# Altium schematic sheet TP_IHM_MAIN.SchDoc
size A4
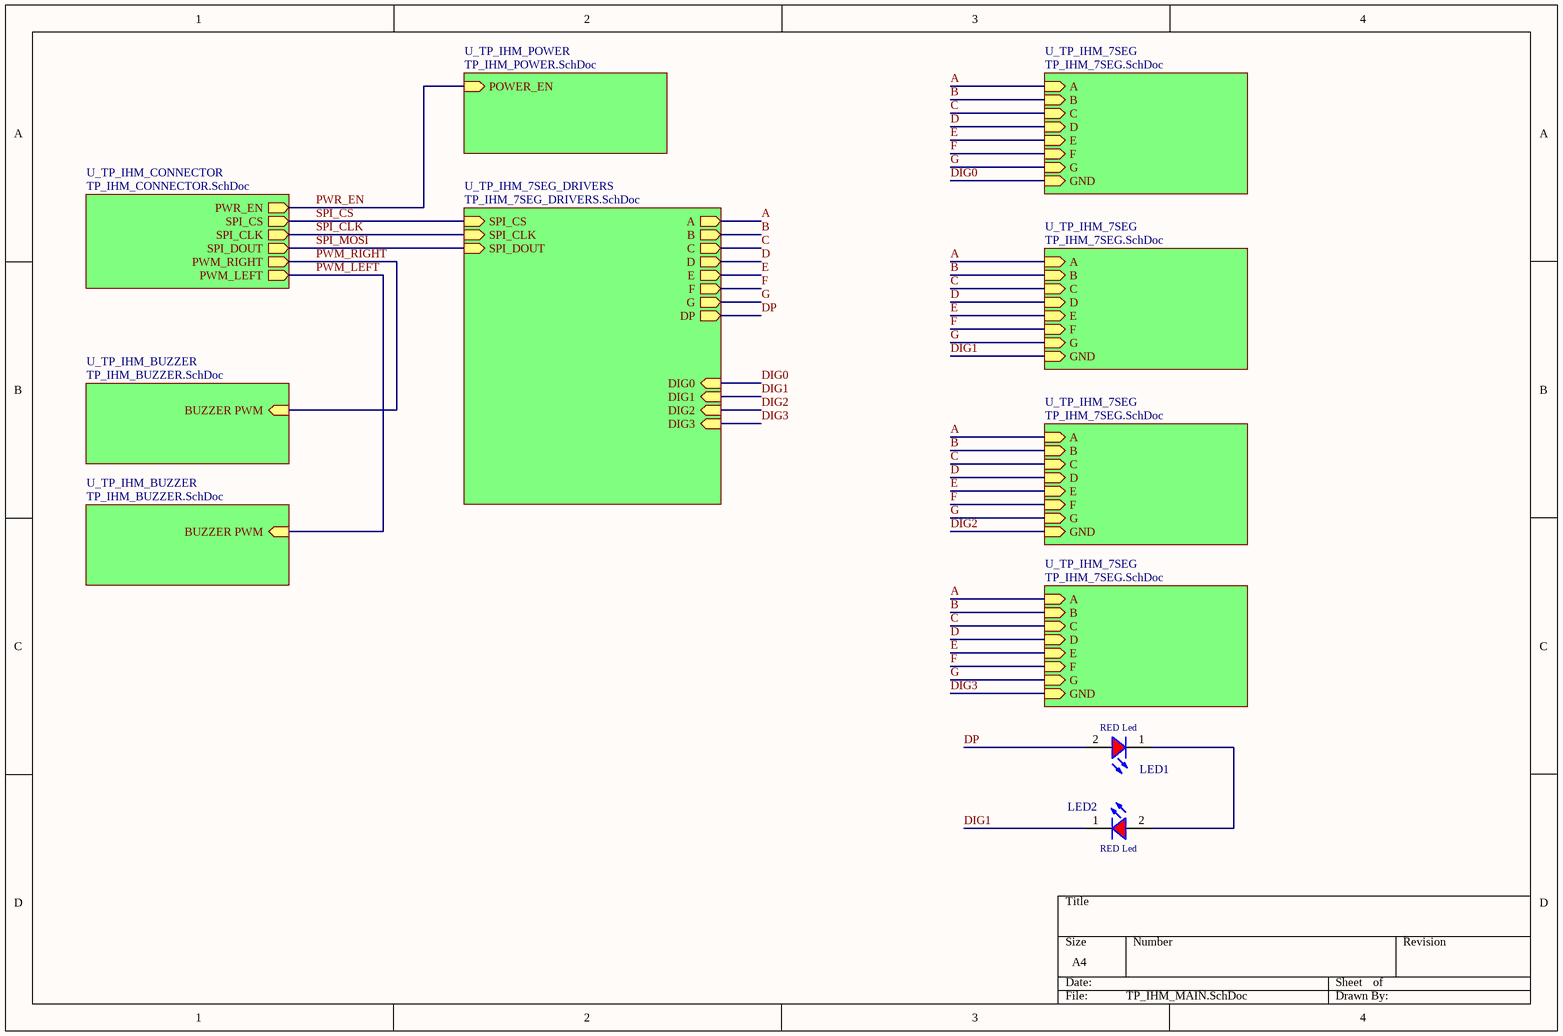
[diagram p0: TP_IHM_MAIN.SchDoc]

## Parts
LED1  RED Led  [LED_0603_RED]
LED2  RED Led  [LED_0603_RED]

## Sub-sheets
U_TP_IHM_7SEG = TP_IHM_7SEG.SchDoc: A (in), B (in), C (in), D (in), E (in), F (in), G (in), GND (in)
U_TP_IHM_7SEG = TP_IHM_7SEG.SchDoc: A (in), B (in), C (in), D (in), E (in), F (in), G (in), GND (in)
U_TP_IHM_7SEG = TP_IHM_7SEG.SchDoc: A (in), B (in), C (in), D (in), E (in), F (in), G (in), GND (in)
U_TP_IHM_7SEG = TP_IHM_7SEG.SchDoc: A (in), B (in), C (in), D (in), E (in), F (in), G (in), GND (in)
U_TP_IHM_7SEG_DRIVERS = TP_IHM_7SEG_DRIVERS.SchDoc: DIG3 (in), DIG2 (in), DIG1 (in), DIG0 (in), DP (out), G (out), F (out), E (out), D (out), C (out), B (out), A (out), SPI_CS (in), SPI_CLK (in), SPI_DOUT (in)
U_TP_IHM_BUZZER = TP_IHM_BUZZER.SchDoc: BUZZER PWM (in)
U_TP_IHM_BUZZER = TP_IHM_BUZZER.SchDoc: BUZZER PWM (in)
U_TP_IHM_CONNECTOR = TP_IHM_CONNECTOR.SchDoc: PWM_LEFT (out), PWM_RIGHT (out), PWR_EN (out), SPI_CS (out), SPI_CLK (out), SPI_DOUT (out)
U_TP_IHM_POWER = TP_IHM_POWER.SchDoc: POWER_EN (in)

## Nets
A: sheet U_TP_IHM_7SEG/A, sheet U_TP_IHM_7SEG/A, sheet U_TP_IHM_7SEG/A, sheet U_TP_IHM_7SEG/A, sheet U_TP_IHM_7SEG_DRIVERS/A
B: sheet U_TP_IHM_7SEG/B, sheet U_TP_IHM_7SEG/B, sheet U_TP_IHM_7SEG/B, sheet U_TP_IHM_7SEG/B, sheet U_TP_IHM_7SEG_DRIVERS/B
C: sheet U_TP_IHM_7SEG/C, sheet U_TP_IHM_7SEG/C, sheet U_TP_IHM_7SEG/C, sheet U_TP_IHM_7SEG/C, sheet U_TP_IHM_7SEG_DRIVERS/C
D: sheet U_TP_IHM_7SEG/D, sheet U_TP_IHM_7SEG/D, sheet U_TP_IHM_7SEG/D, sheet U_TP_IHM_7SEG/D, sheet U_TP_IHM_7SEG_DRIVERS/D
DIG0: sheet U_TP_IHM_7SEG/GND, sheet U_TP_IHM_7SEG_DRIVERS/DIG0
DIG1: LED2.1(K) ; sheet U_TP_IHM_7SEG/GND, sheet U_TP_IHM_7SEG_DRIVERS/DIG1
DIG2: sheet U_TP_IHM_7SEG/GND, sheet U_TP_IHM_7SEG_DRIVERS/DIG2
DIG3: sheet U_TP_IHM_7SEG/GND, sheet U_TP_IHM_7SEG_DRIVERS/DIG3
DP: LED1.2(A) ; sheet U_TP_IHM_7SEG_DRIVERS/DP
E: sheet U_TP_IHM_7SEG/E, sheet U_TP_IHM_7SEG/E, sheet U_TP_IHM_7SEG/E, sheet U_TP_IHM_7SEG/E, sheet U_TP_IHM_7SEG_DRIVERS/E
F: sheet U_TP_IHM_7SEG/F, sheet U_TP_IHM_7SEG/F, sheet U_TP_IHM_7SEG/F, sheet U_TP_IHM_7SEG/F, sheet U_TP_IHM_7SEG_DRIVERS/F
G: sheet U_TP_IHM_7SEG/G, sheet U_TP_IHM_7SEG/G, sheet U_TP_IHM_7SEG/G, sheet U_TP_IHM_7SEG/G, sheet U_TP_IHM_7SEG_DRIVERS/G
PWM_LEFT: sheet U_TP_IHM_BUZZER/BUZZER PWM, sheet U_TP_IHM_CONNECTOR/PWM_LEFT
PWM_RIGHT: sheet U_TP_IHM_BUZZER/BUZZER PWM, sheet U_TP_IHM_CONNECTOR/PWM_RIGHT
PWR_EN: sheet U_TP_IHM_POWER/POWER_EN, sheet U_TP_IHM_CONNECTOR/PWR_EN
SPI_CLK: sheet U_TP_IHM_7SEG_DRIVERS/SPI_CLK, sheet U_TP_IHM_CONNECTOR/SPI_CLK
SPI_CS: sheet U_TP_IHM_7SEG_DRIVERS/SPI_CS, sheet U_TP_IHM_CONNECTOR/SPI_CS
SPI_MOSI: sheet U_TP_IHM_7SEG_DRIVERS/SPI_DOUT, sheet U_TP_IHM_CONNECTOR/SPI_DOUT
NetLED1_1: LED1.1(K) LED2.2(A)

## Library data of the parts
LED1 LED2 = LED_RED_SMD_WE_150060RS750x0: LED RED SMD WE 150060RS750x0; ref: 150060RS750x0